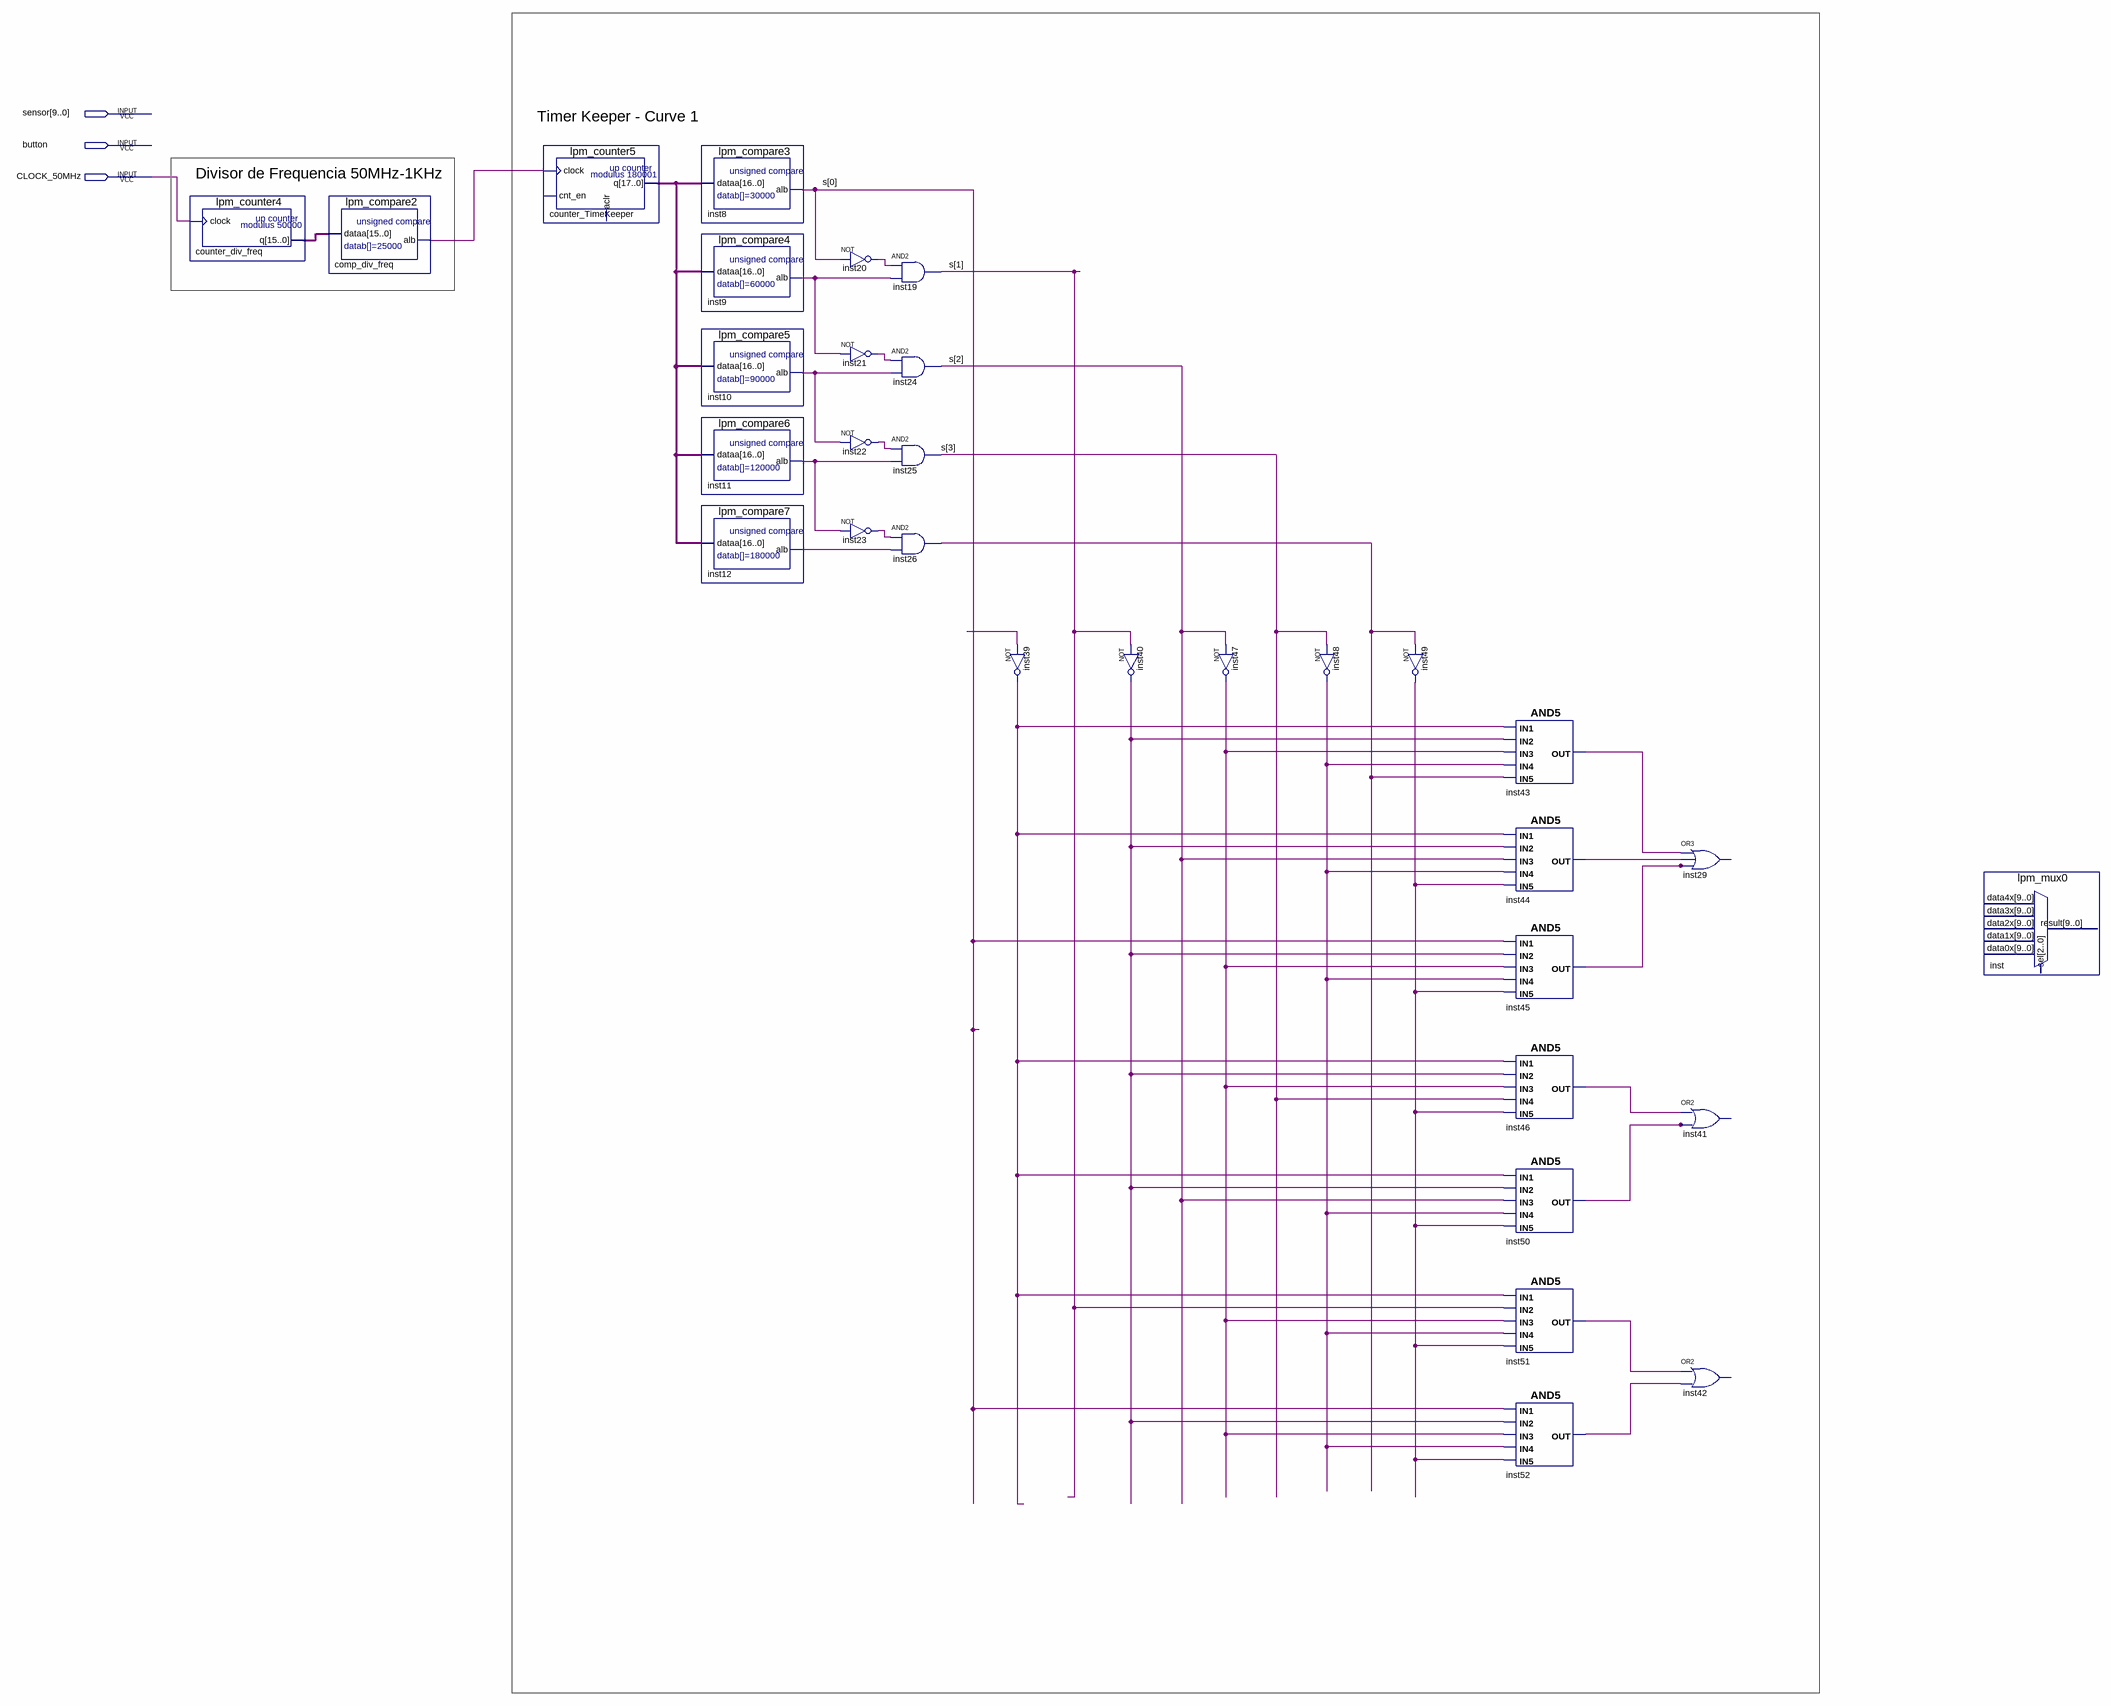
[diagram p0: schematic sheet]
// Quartus schematic controlecooler.bdf as structural Verilog: 32 symbols, 3 pins
module controlecooler (
  input  [9:0] sensor,
  input  button,
  input  CLOCK_50MHz
);

  wire comp_div_freq_alb, inst9_alb, inst10_alb, inst11_alb, inst12_alb, inst20_out, inst21_out, inst22_out,
       inst23_out, inst26_out, inst39_out, inst40_out, inst43_out, inst44_out, inst45_out, inst46_out,
       inst47_out, inst48_out, inst49_out, inst50_out, inst51_out, inst52_out, undriven;
  wire [3:0] s;
  wire [15:0] counter_div_freq_q;
  wire [17:0] counter_TimeKeeper_q;

  lpm_counter4 counter_div_freq (.clock(CLOCK_50MHz), .q(counter_div_freq_q));
  lpm_compare2 comp_div_freq (.dataa(counter_div_freq_q), .alb(comp_div_freq_alb));
  lpm_counter5 counter_TimeKeeper (.clock(comp_div_freq_alb), .q(counter_TimeKeeper_q));  // open: cnt_en, aclr
  lpm_compare3 inst8 (.dataa(counter_TimeKeeper_q), .alb(s[0]));
  lpm_compare4 inst9 (.dataa(counter_TimeKeeper_q), .alb(inst9_alb));
  lpm_compare5 inst10 (.dataa(counter_TimeKeeper_q), .alb(inst10_alb));
  lpm_compare6 inst11 (.dataa(counter_TimeKeeper_q), .alb(inst11_alb));
  lpm_compare7 inst12 (.dataa(counter_TimeKeeper_q), .alb(inst12_alb));
  not inst20 (inst20_out, s[0]);
  not inst21 (inst21_out, inst9_alb);
  not inst22 (inst22_out, inst10_alb);
  not inst23 (inst23_out, inst11_alb);
  and inst19 (s[1], inst20_out, inst9_alb);
  and inst24 (s[2], inst21_out, inst10_alb);
  and inst25 (s[3], inst22_out, inst11_alb);
  and inst26 (inst26_out, inst23_out, inst12_alb);
  not inst39 (inst39_out, undriven);
  not inst40 (inst40_out, s[1]);
  not inst47 (inst47_out, s[2]);
  not inst48 (inst48_out, s[3]);
  not inst49 (inst49_out, inst26_out);
  and inst43 (inst43_out, inst39_out, inst40_out, inst47_out, inst48_out, inst26_out);
  and inst44 (inst44_out, inst39_out, inst40_out, s[2], inst48_out, inst49_out);
  and inst45 (inst45_out, s[0], inst40_out, inst47_out, inst48_out, inst49_out);
  and inst46 (inst46_out, inst39_out, inst40_out, inst47_out, s[3], inst49_out);
  and inst50 (inst50_out, inst39_out, inst40_out, s[2], inst48_out, inst49_out);
  and inst51 (inst51_out, inst39_out, s[1], inst47_out, inst48_out, inst49_out);
  and inst52 (inst52_out, s[0], inst40_out, inst47_out, inst48_out, inst49_out);
  // OR3 inst29 has open pins: IN1=inst43_out, IN2=inst44_out, IN3=inst45_out, OUT=open
  // OR2 inst41 has open pins: IN1=inst46_out, IN2=inst50_out, OUT=open
  // OR2 inst42 has open pins: IN1=inst51_out, IN2=inst52_out, OUT=open
  lpm_mux0 inst ();  // open: data4x, data3x, data2x, data1x, data0x, sel, result

  // Notes on the sheet:
  //   Timer Keeper - Curve 1
  //   Divisor de Frequencia 50MHz-1KHz
endmodule
